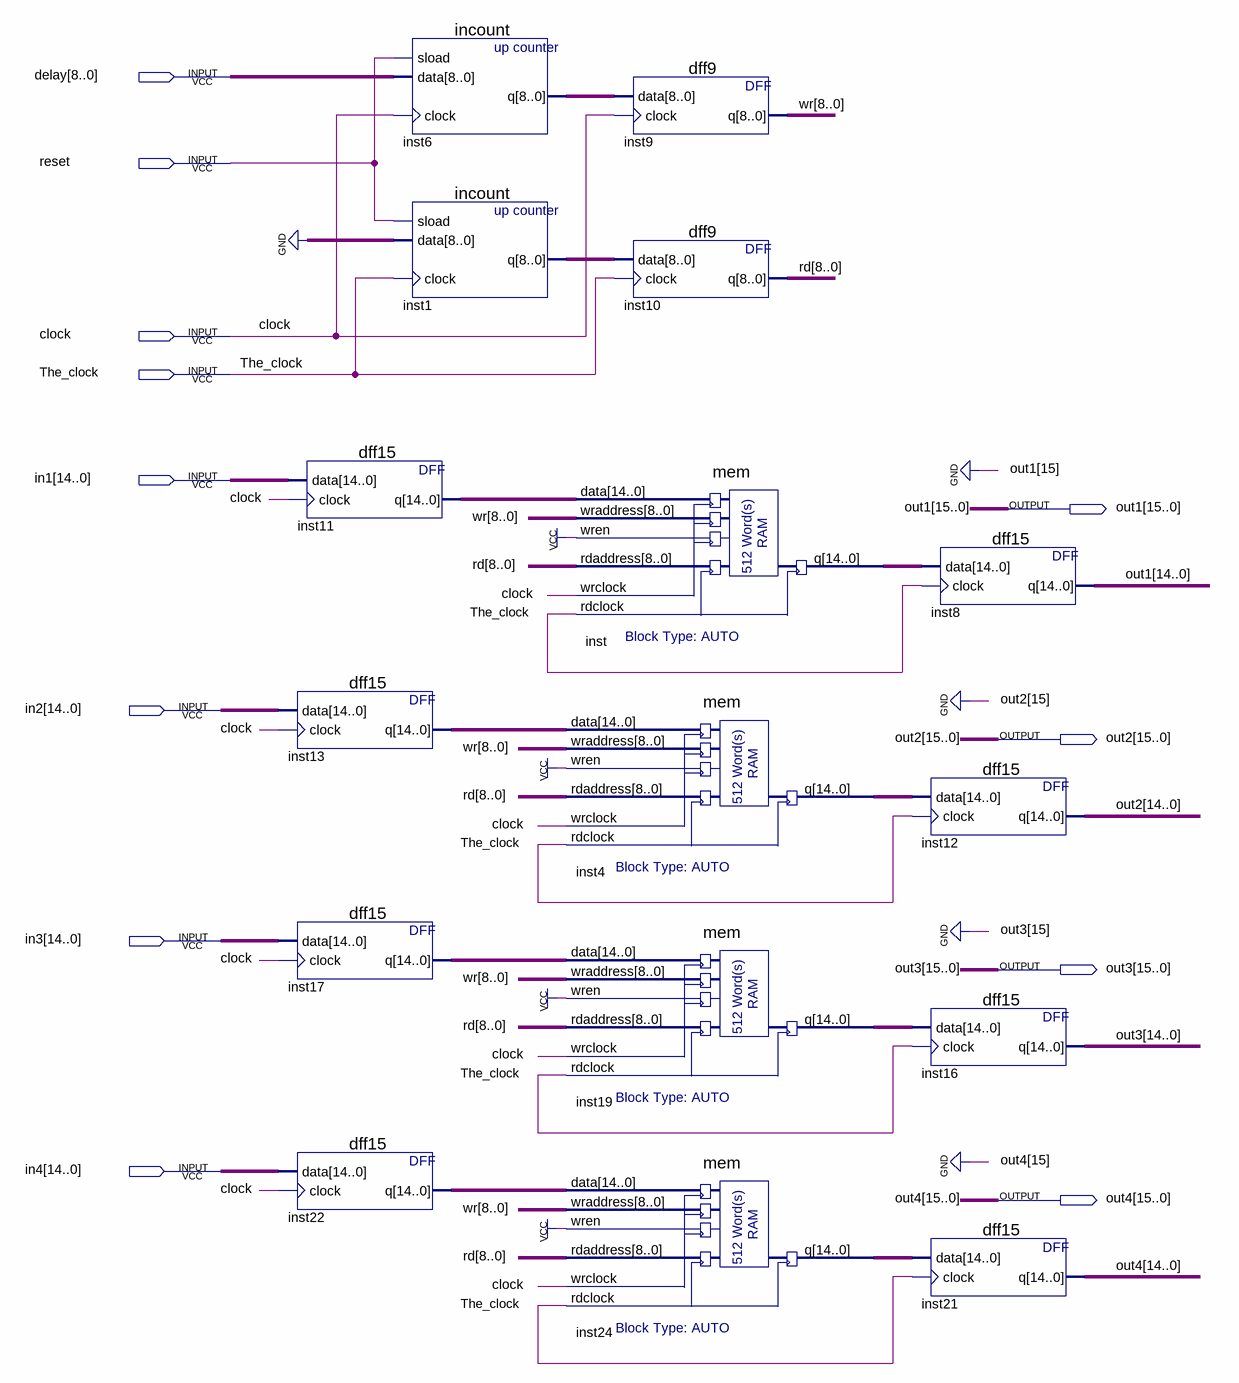
[diagram p0: schematic sheet]
// Quartus schematic Basic_DAQ_Block_trigg.bdf as structural Verilog: 16 symbols, 12 pins
module Basic_DAQ_Block_trigg (
  input  [8:0] delay,
  input  reset,
  input  clock,
  input  The_clock,
  input  [14:0] in1,
  input  [14:0] in2,
  input  [14:0] in3,
  input  [14:0] in4,
  output [15:0] out1,
  output [15:0] out2,
  output [15:0] out3,
  output [15:0] out4
);

  wire [8:0] inst1_q, inst6_q, rd, wr;
  wire [14:0] inst4_q, inst11_q, inst13_q, inst17_q, inst19_q, inst22_q, inst24_q, inst_q;

  dff15 inst11 (.data(in1), .clock(clock), .q(inst11_q));
  dff15 inst13 (.data(in2), .clock(clock), .q(inst13_q));
  dff15 inst17 (.data(in3), .clock(clock), .q(inst17_q));
  dff15 inst22 (.data(in4), .clock(clock), .q(inst22_q));
  incount inst6 (.sload(reset), .data(delay), .clock(clock), .q(inst6_q));
  incount inst1 (.sload(reset), .data({9{1'b0}}), .clock(The_clock), .q(inst1_q));
  mem inst4 (
    .data(inst13_q), .wraddress(wr), .wren(1'b1), .rdaddress(rd), .wrclock(clock), .rdclock(The_clock),
    .q(inst4_q));
  mem inst19 (
    .data(inst17_q), .wraddress(wr), .wren(1'b1), .rdaddress(rd), .wrclock(clock), .rdclock(The_clock),
    .q(inst19_q));
  mem inst24 (
    .data(inst22_q), .wraddress(wr), .wren(1'b1), .rdaddress(rd), .wrclock(clock), .rdclock(The_clock),
    .q(inst24_q));
  dff9 inst9 (.data(inst6_q), .clock(clock), .q(wr));
  dff9 inst10 (.data(inst1_q), .clock(The_clock), .q(rd));
  mem inst (
    .data(inst11_q), .wraddress(wr), .wren(1'b1), .rdaddress(rd), .wrclock(clock), .rdclock(The_clock),
    .q(inst_q));
  dff15 inst8 (.data(inst_q), .clock(The_clock), .q(out1[14:0]));
  dff15 inst12 (.data(inst4_q), .clock(The_clock), .q(out2[14:0]));
  dff15 inst16 (.data(inst19_q), .clock(The_clock), .q(out3[14:0]));
  dff15 inst21 (.data(inst24_q), .clock(The_clock), .q(out4[14:0]));

  assign out1[15] = 1'b0;
  assign out2[15] = 1'b0;
  assign out3[15] = 1'b0;
  assign out4[15] = 1'b0;
endmodule
